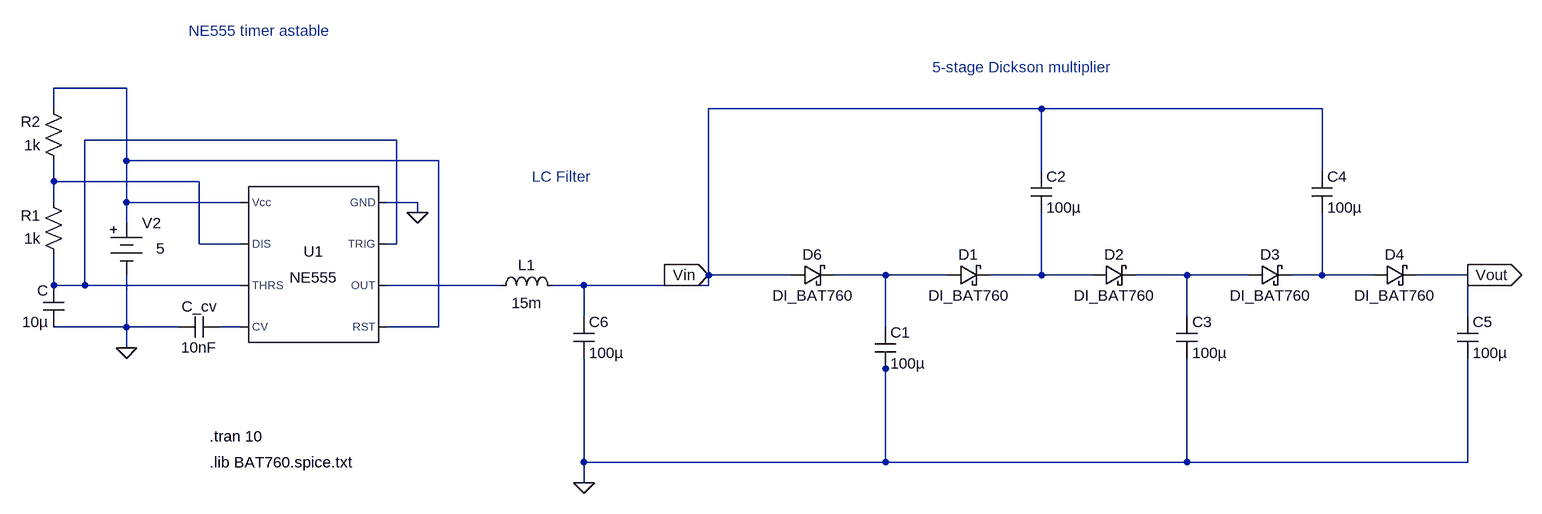
[diagram p0: schematic 5-stage Dickson multiplier.asc]
5-stage Dickson multiplier.asc, the LTspice schematic file:
Version 4
SHEET 1 1744 1540
WIRE -848 736 -960 736
WIRE -960 768 -960 736
WIRE 560 768 48 768
WIRE 992 768 560 768
WIRE -432 816 -912 816
WIRE -848 848 -848 736
WIRE -368 848 -848 848
WIRE 560 864 560 768
WIRE 992 864 992 768
WIRE -960 880 -960 848
WIRE -736 880 -960 880
WIRE -960 912 -960 880
WIRE -848 912 -848 848
WIRE -672 912 -848 912
WIRE -400 912 -448 912
WIRE -400 928 -400 912
WIRE -848 944 -848 912
WIRE -736 976 -736 880
WIRE -672 976 -736 976
WIRE -432 976 -432 816
WIRE -432 976 -448 976
WIRE 48 1024 48 768
WIRE 176 1024 48 1024
WIRE 320 1024 240 1024
WIRE 416 1024 320 1024
WIRE 560 1024 560 928
WIRE 560 1024 480 1024
WIRE 640 1024 560 1024
WIRE 784 1024 704 1024
WIRE 880 1024 784 1024
WIRE 992 1024 992 928
WIRE 992 1024 944 1024
WIRE 1072 1024 992 1024
WIRE 1216 1024 1136 1024
WIRE -960 1040 -960 992
WIRE -912 1040 -912 816
WIRE -912 1040 -960 1040
WIRE -672 1040 -912 1040
WIRE -272 1040 -448 1040
WIRE -144 1040 -192 1040
WIRE 48 1040 48 1024
WIRE 48 1040 -144 1040
WIRE -144 1088 -144 1040
WIRE 784 1088 784 1024
WIRE 1216 1088 1216 1024
WIRE -848 1104 -848 1024
WIRE -848 1104 -960 1104
WIRE -768 1104 -848 1104
WIRE -672 1104 -704 1104
WIRE -368 1104 -368 848
WIRE -368 1104 -448 1104
WIRE 320 1104 320 1024
WIRE -848 1136 -848 1104
WIRE 320 1168 320 1152
WIRE -144 1312 -144 1152
WIRE 320 1312 320 1168
WIRE 320 1312 -144 1312
WIRE 784 1312 784 1152
WIRE 784 1312 320 1312
WIRE 1216 1312 1216 1152
WIRE 1216 1312 784 1312
WIRE -144 1344 -144 1312
FLAG -144 1344 0
FLAG 48 1024 Vin
IOPIN 48 1024 In
FLAG 1216 1024 Vout
IOPIN 1216 1024 Out
FLAG -400 928 0
FLAG -848 1136 0
SYMBOL cap 304 1104 R0
SYMATTR InstName C1
SYMATTR Value 100µ
SYMBOL cap 544 864 R0
SYMATTR InstName C2
SYMATTR Value 100µ
SYMBOL cap 768 1088 R0
SYMATTR InstName C3
SYMATTR Value 100µ
SYMBOL cap 976 864 R0
SYMATTR InstName C4
SYMATTR Value 100µ
SYMBOL cap 1200 1088 R0
SYMATTR InstName C5
SYMATTR Value 100µ
SYMBOL schottky 176 1040 R270
WINDOW 0 32 32 VTop 2
WINDOW 3 0 32 VBottom 2
SYMATTR InstName D6
SYMATTR Value DI_BAT760
SYMBOL schottky 416 1040 R270
WINDOW 0 32 32 VTop 2
WINDOW 3 0 32 VBottom 2
SYMATTR InstName D1
SYMATTR Value DI_BAT760
SYMBOL schottky 640 1040 R270
WINDOW 0 32 32 VTop 2
WINDOW 3 0 32 VBottom 2
SYMATTR InstName D2
SYMATTR Value DI_BAT760
SYMBOL schottky 880 1040 R270
WINDOW 0 32 32 VTop 2
WINDOW 3 0 32 VBottom 2
SYMATTR InstName D3
SYMATTR Value DI_BAT760
SYMBOL schottky 1072 1040 R270
WINDOW 0 32 32 VTop 2
WINDOW 3 0 32 VBottom 2
SYMATTR InstName D4
SYMATTR Value DI_BAT760
SYMBOL Misc\\NE555 -560 1008 M0
SYMATTR InstName U1
SYMBOL Misc\\battery -848 928 R0
WINDOW 3 46 55 Left 2
WINDOW 123 0 0 Left 0
WINDOW 39 0 0 Left 0
SYMATTR Value 5
SYMATTR InstName V2
SYMBOL cap -704 1088 R90
WINDOW 0 0 32 VBottom 2
WINDOW 3 32 32 VTop 2
SYMATTR InstName C_cv
SYMATTR Value 10nF
SYMBOL cap -944 1104 R180
WINDOW 0 24 56 Left 2
WINDOW 3 24 8 Left 2
SYMATTR InstName C
SYMATTR Value 10µ
SYMBOL res -944 1008 R180
WINDOW 0 36 76 Left 2
WINDOW 3 36 40 Left 2
SYMATTR InstName R1
SYMATTR Value 1k
SYMBOL res -944 864 R180
WINDOW 0 36 76 Left 2
WINDOW 3 36 40 Left 2
SYMATTR InstName R2
SYMATTR Value 1k
SYMBOL ind -288 1056 R270
WINDOW 0 32 56 VTop 2
WINDOW 3 5 56 VBottom 2
SYMATTR InstName L1
SYMATTR Value 15m
SYMBOL cap -160 1088 R0
SYMATTR InstName C6
SYMATTR Value 100µ
TEXT -720 1272 Left 2 !.tran 10
TEXT -720 1312 Left 2 !.lib BAT760.spice.txt
TEXT 392 704 Left 2 ;5-stage Dickson multiplier
TEXT -752 648 Left 2 ;NE555 timer astable
TEXT -224 872 Left 2 ;LC Filter

The netlist it stands for:
* 5-stage Dickson multiplier.asc
C1 N004 0 100µ
C2 Vin N005 100µ
C3 N006 0 100µ
C4 Vin N007 100µ
C5 Vout 0 100µ
D6 Vin N004 DI_BAT760
D1 N004 N005 DI_BAT760
D2 N005 N006 DI_BAT760
D3 N006 N007 DI_BAT760
D4 N007 Vout DI_BAT760
XU1 0 N002 N008 N001 N009 N002 N003 N001 NE555  ; pins GND TRIG OUT RST CV THRS DIS Vcc
V2 N001 0 5
C_cv N009 0 10nF
C 0 N002 10µ
R1 N002 N003 1k
R2 N003 N001 1k
L1 N008 Vin 15m
C6 Vin 0 100µ
.model D D
.lib standard.dio
.tran 10
.lib BAT760.spice.txt
* 5-stage Dickson multiplier
* NE555 timer astable
* LC Filter
.lib NE555.sub
.backanno
.end